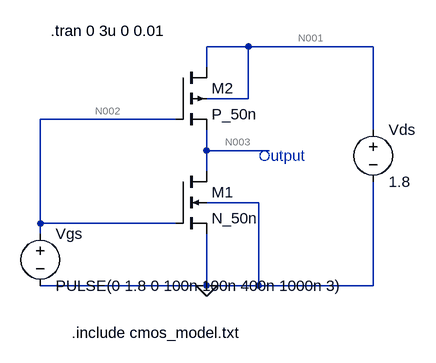
[diagram p0: schematic cmos inv.asc]
cmos inv.asc, the LTspice schematic file:
Version 4
SHEET 1 1040 4516
WIRE 256 0 192 0
WIRE 448 0 256 0
WIRE 192 32 192 0
WIRE 256 80 256 0
WIRE 256 80 192 80
WIRE 144 112 -64 112
WIRE 448 128 448 0
WIRE 192 160 192 128
WIRE 288 160 192 160
WIRE 192 192 192 160
WIRE 272 240 192 240
WIRE -64 272 -64 112
WIRE 144 272 -64 272
WIRE -64 288 -64 272
WIRE 192 368 192 288
WIRE 192 368 -64 368
WIRE 272 368 272 240
WIRE 272 368 192 368
WIRE 448 368 448 208
WIRE 448 368 272 368
FLAG 192 368 0
SYMBOL nmos4 144 192 R0
SYMATTR InstName M1
SYMATTR Value N_50n
SYMBOL pmos4 144 32 R0
SYMATTR InstName M2
SYMATTR Value P_50n
SYMBOL voltage -64 272 R0
WINDOW 123 0 0 Left 0
WINDOW 39 0 0 Left 0
SYMATTR InstName Vgs
SYMATTR Value PULSE(0 1.8 0 100n 100n 400n 1000n 3)
SYMBOL voltage 448 112 R0
WINDOW 123 0 0 Left 0
WINDOW 39 0 0 Left 0
SYMATTR InstName Vds
SYMATTR Value 1.8
TEXT 272 168 Left 2 ;Output
TEXT -48 -24 Left 2 !.tran 0 3u 0 0.01
TEXT -16 440 Left 2 !.include cmos_model.txt

The netlist it stands for:
* cmos inv.asc
M1 N003 N002 0 0 N_50n
M2 N001 N002 N003 N001 P_50n
Vgs N002 0 PULSE(0 1.8 0 100n 100n 400n 1000n 3)
Vds N001 0 1.8
.model NMOS NMOS
.model PMOS PMOS
.lib standard.mos
* Output
.tran 0 3u 0 0.01
.include cmos_model.txt
.backanno
.end

* Results of the author's LTspice run, read from the files saved beside the schematic
* Operating Point, zero values left out:
*   V(n003) = 1.628 V
*   V(n001) = 1.8 V
*   Id(M2) = 5.848 µA
*   Ig(M2) = -1.288 mA
*   Ib(M2) = 1.287 mA
*   Is(M2) = -4.754 µA
*   Id(M1) = 4.754 µA
*   Ig(M1) = -102.1 nA
*   Ib(M1) = -4.646 µA
*   Is(M1) = -6.821 nA
*   I(Vds) = -1.293 mA
*   I(Vgs) = 1.288 mA
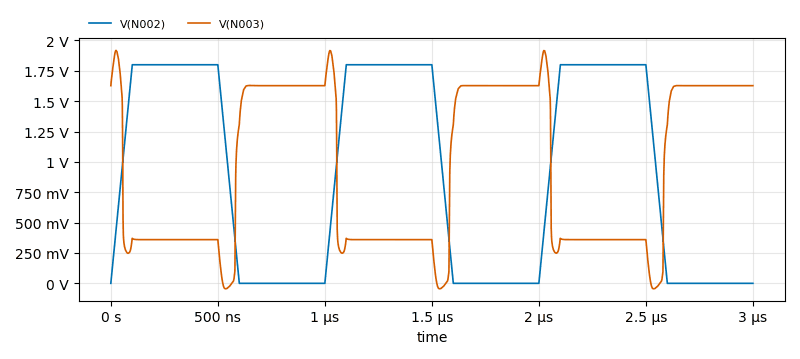
[diagram p1: Transient Analysis of cmos inv.asc, plotted from the saved traces]
* Transient Analysis, 1 run:
*   V(N002): min 0 V, max 1.8 V, average 900 mV, rms 1.23 V, last 0 V
*   V(N003): min -45.03 mV, max 1.918 V, average 927.8 mV, rms 1.143 V, last 1.628 V